# EasyEDA schematic TP5400电池充电器测试板_2021-06-20.json
TITLE: TP5400充电板测试板; REV: 1.0; Date: 2021-06-01; Sheet: 1/1; Company: sethome
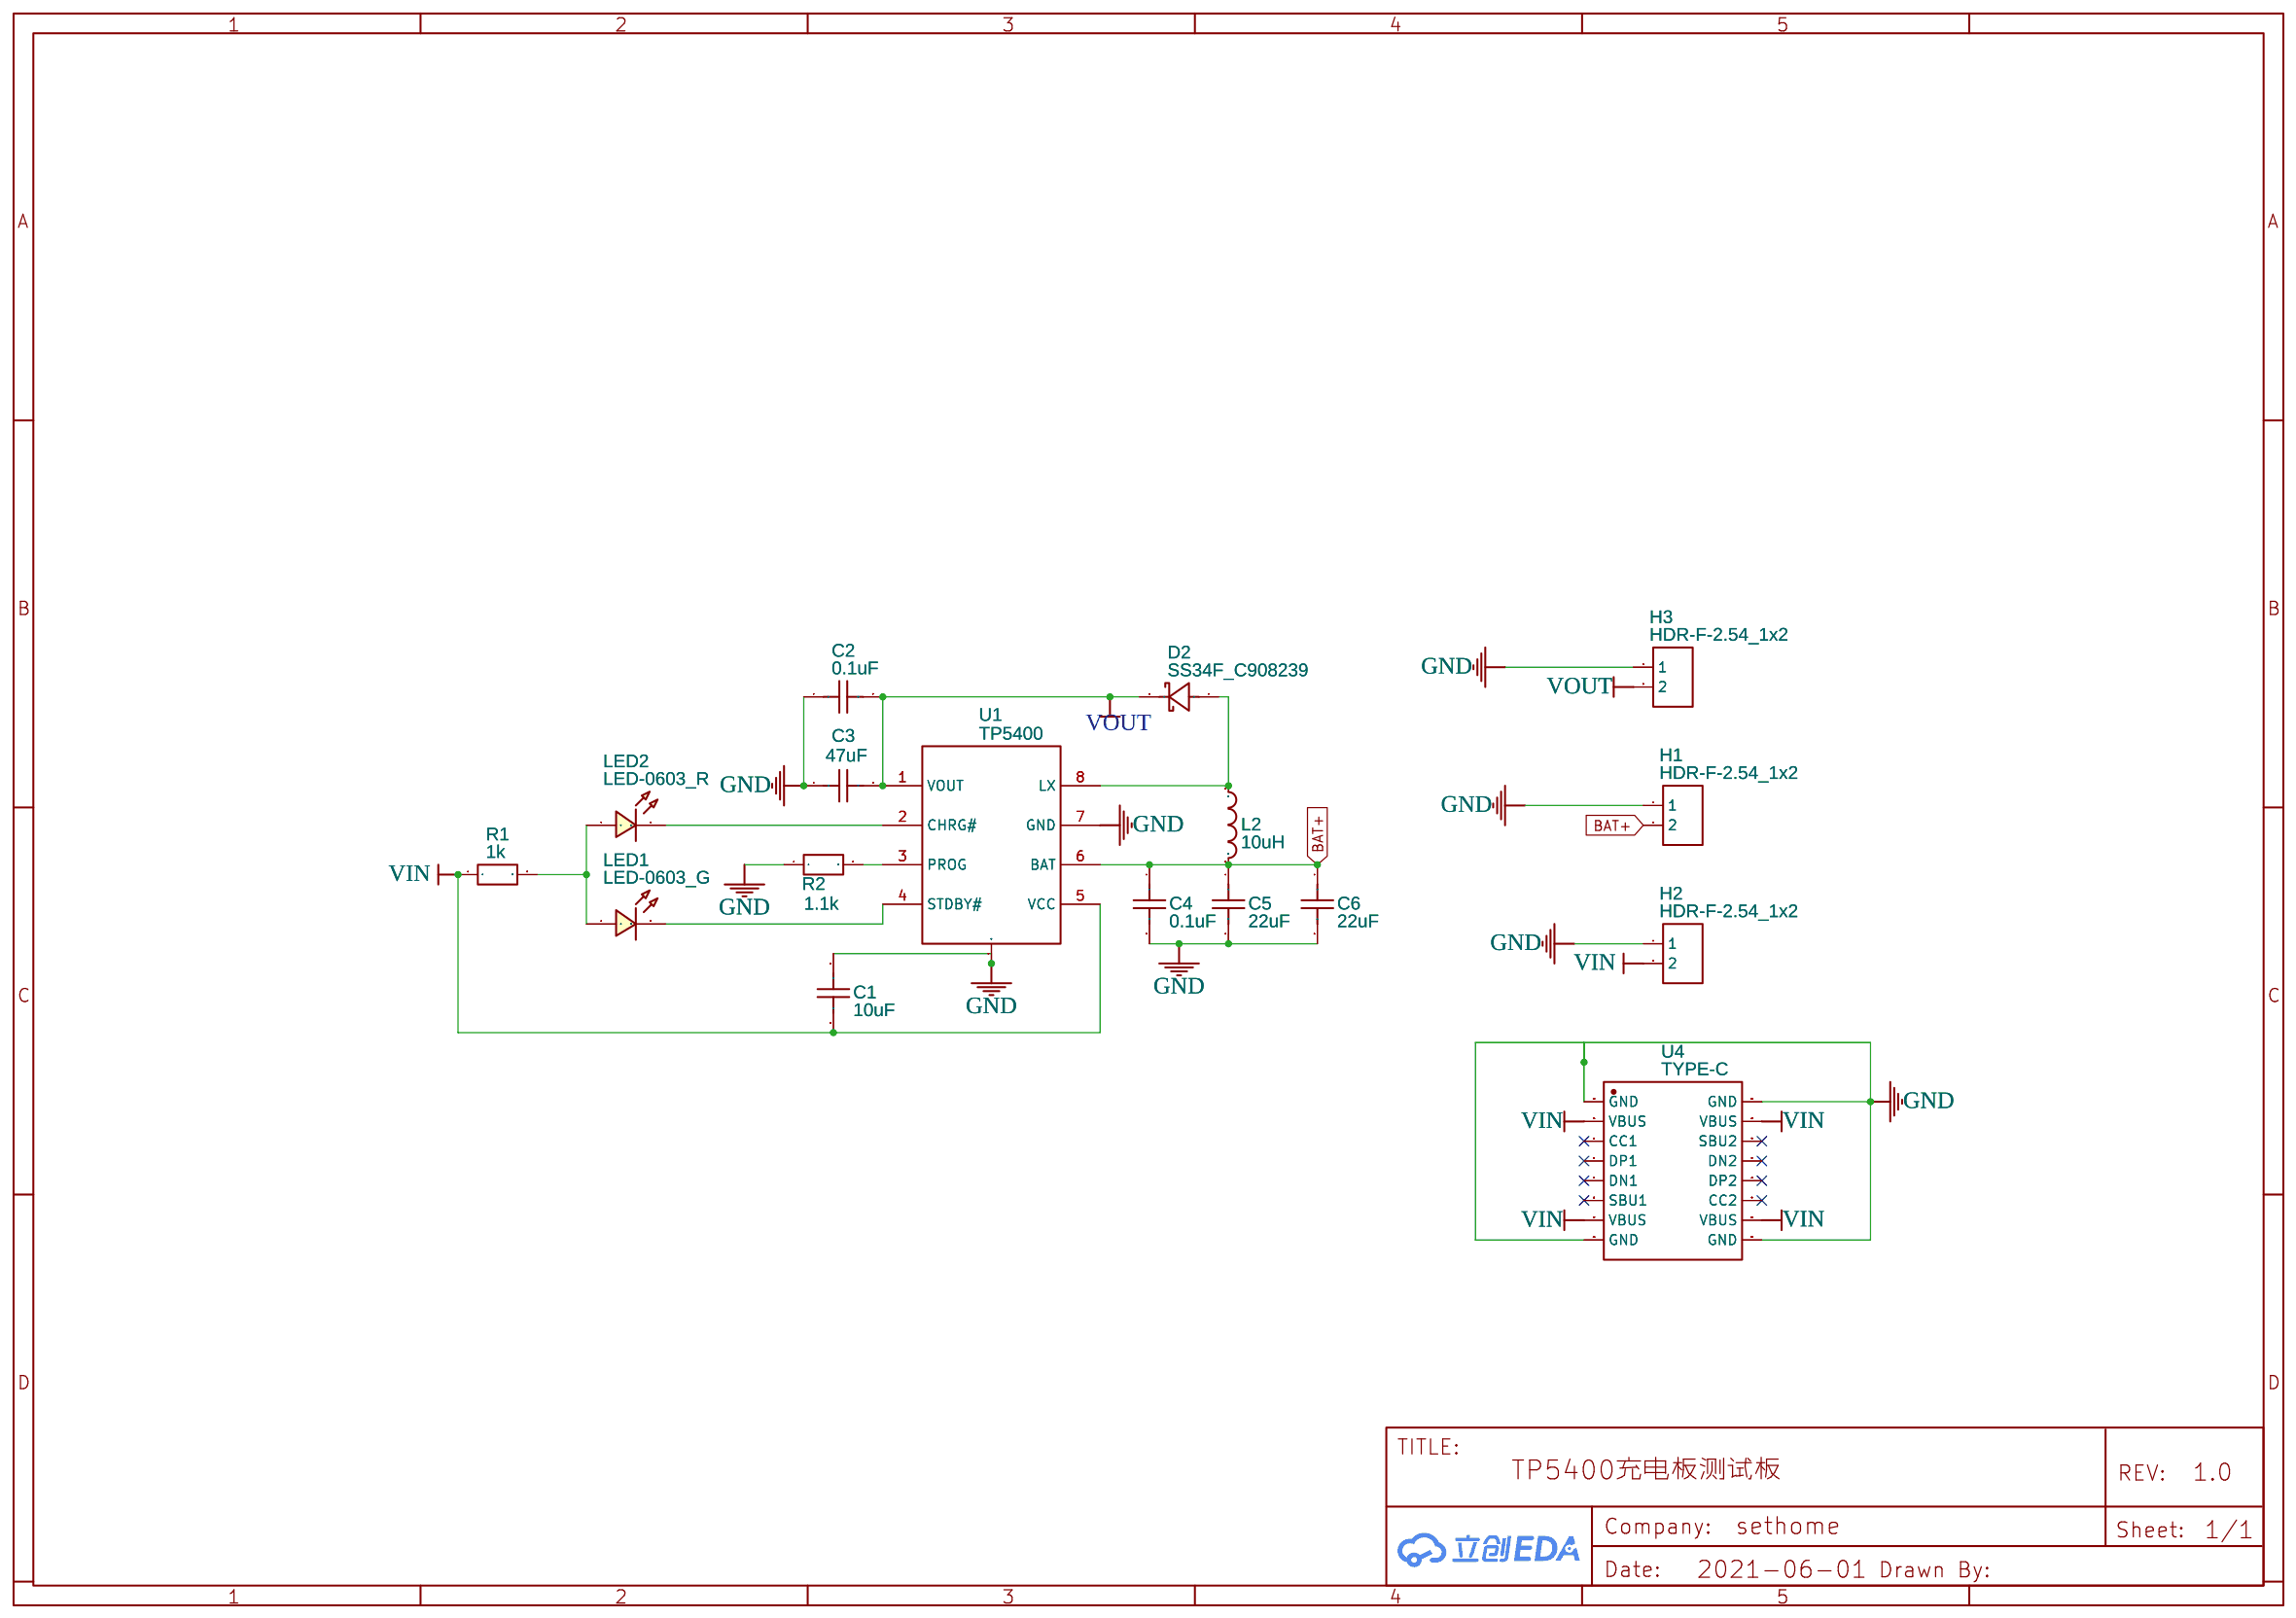
[diagram p0: schematic sheet]

## Parts
C1  10uF  [C0603]
C2  0.1uF  [C0603]
C3  47uF  [C1206]
C4  0.1uF  [C0603]
C5  22uF  [C0603]
C6  22uF  [C0603]
D2  SS34F_C908239  [SMAF_L3.5-W2.6-LS4.7-FD]
H1  HDR-F-2.54_1x2  [HDR-F-2.54_1X2]
H2  HDR-F-2.54_1x2  [HDR-F-2.54_1X2]
H3  HDR-F-2.54_1x2  [HDR-F-2.54_1X2]
L2  10uH  [IND-SMD_L7.0-W6.6]
LED1  LED-0603_G  [LED0603_GREEN]
LED2  LED-0603_R  [LED0603_RED]
R1  1k  [R0603]
R2  1.1k  [R0603]
U1  TP5400  [SOIC-8_L5.0-W4.0-P1.27-LS6.0-BL-EP]
U4  TYPE-C  [TYPEC-16PIN-四角贴板]

## Library data of the parts
C1 C2 C4-C6 = C_0603_US: Contributor: LCEDA_Lib
C3 = C_1206_US: Contributor: LCEDA_Lib
D2 = SS34F_C908239: Supplier: LCSC; Supplier Part: C908239; Manufacturer: FUXINSEMI; Manufacturer Part: SS34F; Contributor: LCSC
H1-H3 = HDR-F-2.54_1x2: Supplier Part: C49661; Supplier: LCSC; Contributor: LCEDA_Lib
L2 = FXL0630-100-M: Supplier: LCSC; Manufacturer: cjiang; Contributor: LCSC; Supplier Part: C167223; Paste Type: expand
LED1 = LED-0603_G: Manufacturer: EVERLIGHT(台湾亿光); Manufacturer Part: 19-217/GHC-YR1S2/3T; Supplier Part: C72043; Supplier: LCSC; Contributor: LCEDA_Lib
LED2 = LED-0603_R: Manufacturer: EVERLIGHT(台湾亿光); Manufacturer Part: 19-217/R6C-AL1M2VY/3T; Supplier Part: C72044; Supplier: LCSC; Contributor: LCEDA_01
R1 R2 = R_0603_EU: Contributor: LCEDA_Lib
U1 = TP5400: Supplier: LCSC; Manufacturer: TOPPOWER; Supplier Part: C24154; JLCPCB Part Class: Extended Part
U4 = TYPE-C: Contributor: WQM_Editor

## Nets
GND: C1.1 C2.1 C3.1 C4.2 C5.2 C6.2 H1.1 H2.1 H3.1 R2.1 U1.7(GND) U1.9 U4.A1/B12(GND) U4.B1/A12(GND)
VIN: C1.2 H2.2 R1.1 U1.5(VCC) U4.A4/B9(VBUS) U4.B4/A9(VBUS)
BAT+: C4.1 C5.1 C6.1 H1.2 L2.2 U1.6(BAT)
VOUT: C2.2 C3.2 D2.2(K) H3.2 U1.1(VOUT)
Net-(D2-1): D2.1(A) L2.1 U1.8(LX)
Net-(LED1-1): LED1.1 LED2.1 R1.2
Net-(LED1-2): LED1.2 U1.4(STDBY#)
Net-(LED2-2): LED2.2 U1.2(CHRG#)
Net-(R2-2): R2.2 U1.3(PROG)

Not connected (* = marked no-connect by the designer): U4 A5(CC1)* A6(DP1)* A7(DN1)* A8(SBU1)* B5(CC2)* B6(DP2)* B7(DN2)* B8(SBU2)*
